# EAGLE design decoder (EAGLE 7.2.0)
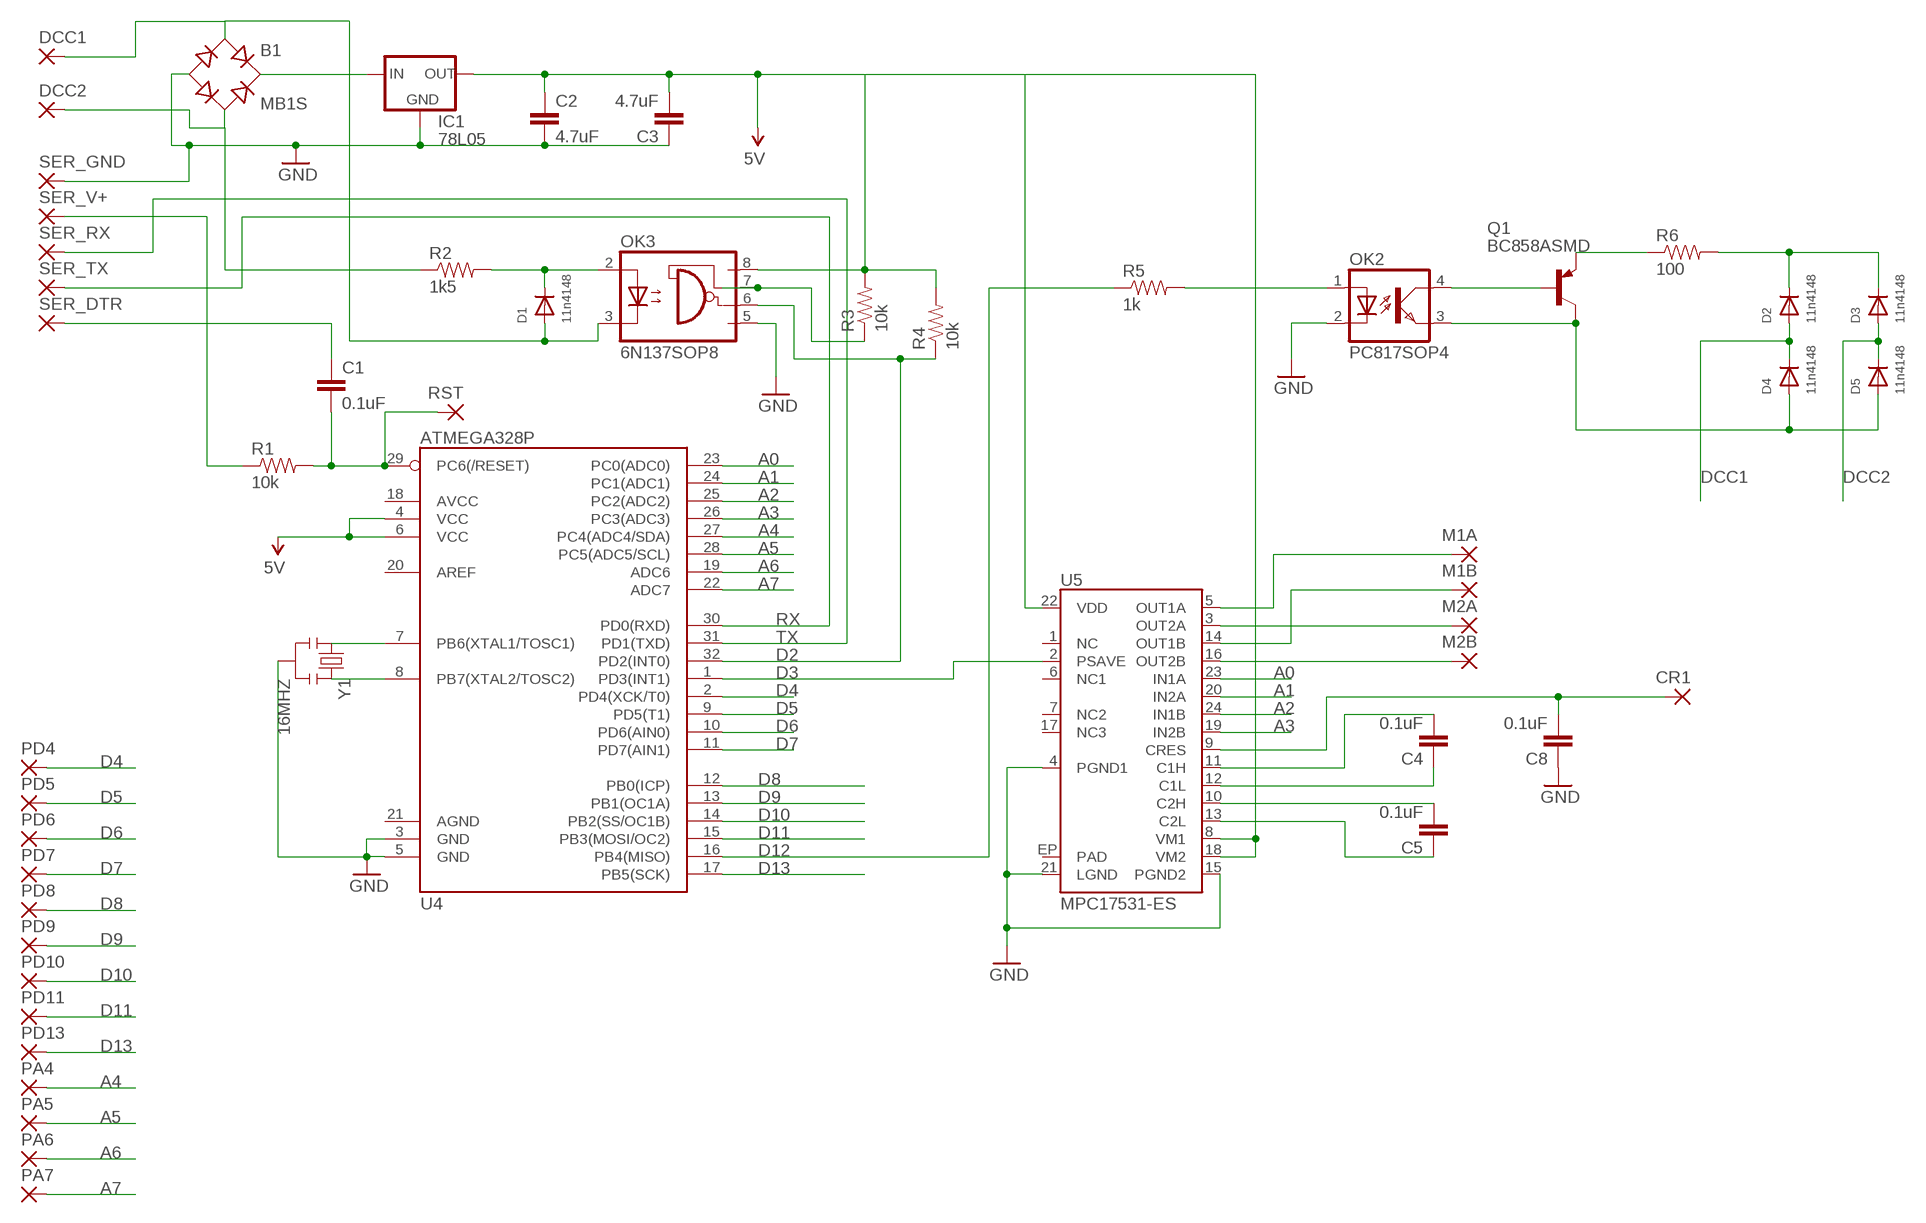
[diagram p0: schematic, sheet 1]

## Parts
B1  MB1S  [SOIC-4]
C1  0.1uF  CAP0805  [0805]
C2  4.7uF  CAP0805  [0805]
C3  4.7uF  CAP0805  [0805]
C4  0.1uF  CAP0805  [0805]
C5  0.1uF  CAP0805  [0805]
C8  0.1uF  CAP0805  [0805]
CR1  SMD2  [SMD1,27-2,54]
D1  11n4148  DIODESOD-123  [SOD-123]
D2  11n4148  DIODESOD-123  [SOD-123]
D3  11n4148  DIODESOD-123  [SOD-123]
D4  11n4148  DIODESOD-123  [SOD-123]
D5  11n4148  DIODESOD-123  [SOD-123]
DCC1  SMD2  [SMD1,27-2,54]
DCC2  SMD2  [SMD1,27-2,54]
IC1  78L05  XC63FPP  [SOT89R]
M1A  SMD2  [SMD1,27-2,54]
M1B  SMD2  [SMD1,27-2,54]
M2A  SMD2  [SMD1,27-2,54]
M2B  SMD2  [SMD1,27-2,54]
OK2  PC817SOP4  [SOP4]
OK3  6N137SOP8  [SOIC08]
PA4  SMD2  [SMD1,27-2,54]
PA5  SMD2  [SMD1,27-2,54]
PA6  SMD2  [SMD1,27-2,54]
PA7  SMD2  [SMD1,27-2,54]
PD4  SMD2  [SMD1,27-2,54]
PD5  SMD2  [SMD1,27-2,54]
PD6  SMD2  [SMD1,27-2,54]
PD7  SMD2  [SMD1,27-2,54]
PD8  SMD2  [SMD1,27-2,54]
PD9  SMD2  [SMD1,27-2,54]
PD10  SMD2  [SMD1,27-2,54]
PD11  SMD2  [SMD1,27-2,54]
PD13  SMD2  [SMD1,27-2,54]
Q1  BC858ASMD  [SOT23-BEC]
R1  10k  RESISTOR0603-RES  [0603-RES]
R2  1k5  RESISTOR0603-RES  [0603-RES]
R3  10k  RESISTOR0603-RES  [0603-RES]
R4  10k  RESISTOR0603-RES  [0603-RES]
R5  1k  RESISTOR0603-RES  [0603-RES]
R6  100  RESISTOR0603-RES  [0603-RES]
RST  SMD2  [SMD1,27-2,54]
SER_DTR  SMD2  [SMD1,27-2,54]
SER_GND  SMD2  [SMD1,27-2,54]
SER_RX  SMD2  [SMD1,27-2,54]
SER_TX  SMD2  [SMD1,27-2,54]
SER_V+  SMD2  [SMD1,27-2,54]
U4  ATMEGA328P  ATMEGA328_SMT  [TQFP32-08]
U5  MPC17531-ES  [QFN-24_ALT2]
Y1  16MHZ  RESONATOR16MHZ  [RESONATOR-SMD]

## Nets
A0: U4.23(PC0(ADC0)) U5.23(IN1A)
A1: U4.24(PC1(ADC1)) U5.20(IN2A)
A2: U4.25(PC2(ADC2)) U5.24(IN1B)
A3: U4.26(PC3(ADC3)) U5.19(IN2B)
A4: PA4.1(P) U4.27(PC4(ADC4/SDA))
A5: PA5.1(P) U4.28(PC5(ADC5/SCL))
A6: PA6.1(P) U4.19(ADC6)
A7: PA7.1(P) U4.22(ADC7)
D2: OK3.6(VO) R4.1 U4.32(PD2(INT0))
D3: U4.1(PD3(INT1)) U5.2(PSAVE)
D4: PD4.1(P) U4.2(PD4(XCK/T0))
D5: PD5.1(P) U4.9(PD5(T1))
D6: PD6.1(P) U4.10(PD6(AIN0))
D7: PD7.1(P) U4.11(PD7(AIN1))
D8: PD8.1(P) U4.12(PB0(ICP))
D9: PD9.1(P) U4.13(PB1(OC1A))
D10: PD10.1(P) U4.14(PB2(SS/OC1B))
D11: PD11.1(P) U4.15(PB3(MOSI/OC2))
D12: R5.1 U4.16(PB4(MISO))
D13: PD13.1(P) U4.17(PB5(SCK))
DCC1: B1.~1(AC1) D1.A D2.A D4.C DCC1.1(P) OK3.3(C)
DCC2: B1.~2(AC2) D3.A D5.C DCC2.1(P) R2.1
GND: B1.- C2.2 C3.1 C8.1 IC1.1(GND) OK2.2(C) OK3.5(GND) SER_GND.1(P) U4.3(GND) U4.5(GND) U5.4(PGND1) U5.15(PGND2) U5.21(LGND) Y1.2
N$1: C4.2 U5.11(C1H)
N$2: U4.7(PB6(XTAL1/TOSC1)) Y1.1
N$3: C1.1 SER_DTR.1(P)
N$4: U4.8(PB7(XTAL2/TOSC2)) Y1.3
N$5: C1.2 R1.2 RST.1(P) U4.29(PC6(/RESET))
N$6: C4.1 U5.12(C1L)
N$7: C5.2 U5.10(C2H)
N$8: D1.C OK3.2(A) R2.2
N$9: R1.1 SER_V+.1(P)
N$10: M1A.1(P) U5.5(OUT1A)
N$12: C5.1 U5.13(C2L)
N$13: OK3.7(VE) R3.1
N$14: M2A.1(P) U5.3(OUT2A)
N$15: M1B.1(P) U5.14(OUT1B)
N$16: OK2.1(A) R5.2
N$17: M2B.1(P) U5.16(OUT2B)
N$18: OK2.4(COL) Q1.B
N$19: D4.A D5.A OK2.3(EMIT) Q1.C
N$20: C8.2 CR1.1(P) U5.9(CRES)
N$21: Q1.E R6.1
N$23: U5.22(VDD)
N$24: D2.C D3.C R6.2
N$26: B1.+ IC1.2(IN)
RX: SER_TX.1(P) U4.30(PD0(RXD))
TX: SER_RX.1(P) U4.31(PD1(TXD))
VCC: C2.1 C3.2 IC1.3(OUT) OK3.8(VCC) R3.2 R4.2 U4.4(VCC) U4.6(VCC) U5.8(VM1) U5.18(VM2) ; supply symbol labelled 5V
Unconnected: U4.18(AVCC) U4.20(AREF) U4.21(AGND) U5.1(NC) U5.6(NC1) U5.7(NC2) U5.17(NC3) U5.EP(PAD)

## Library data of the parts
B1 = rectifier:MB*S: Bridge Rectifier Source: http://www.fairchildsemi.com/ds/MB/MB6S.pdf
C1-C5 C8 = SparkFun-Capacitors:CAP: Capacitor Standard 0603 ceramic capacitor, and 0.1" leaded capacitor.
CR1 DCC1 DCC2 M1A M1B M2A M2B PA4-PA7 PD4-PD11 PD13 RST SER_DTR SER_GND SER_RX SER_TX SER_V+ = wirepad:SMD2: SMD PAD
D1-D5 = adafruit:DIODE: Diode SMADIODE - SMA Surface Mount Package 20V 1A Schottky Diode Digikey: 641-1014-6-ND DO-1N4148 - Through Hole Small Current Diode SOD-123 20V 1 A (.5mV Vf) Schottky Diode - Digikey: MBRX120TPMSCT-ND SOD-323 10V 570mA (.38mV Vf, 3ns) Schottky Diode - Digikey: ZLLS410CT-ND SOD-523 30V 30mA Schottky Diode (RB751S-40TE61) - Digikey: RB751S-40TE61CT-ND SOT23-R/W - SOT23 Package (R = Solder Paste/Reflow Ovens, W = Hand-Soldering) BAT54Film 40V 300mA - Digikey: 497-7162-1-ND
IC1 = v-reg:XC63FP: Positiv Voltage Regulators www.torex.co.jp/english/product/pro02/pdf/0201_xc62fp.pdf
OK2 = optocoupler:PC817: SHARP OPTO COUPLER
OK3 = optocoupler:6N137: MOTOROLA OPTO COUPLER
Q1 = transistor-pnp:BC858*: PNP Transistror
R1-R6 = SparkFun-Resistors:RESISTOR: Resistor Basic schematic elements and footprints for 0603, 1206, and PTH resistors.
U4 = SparkFun-DigitalIC:ATMEGA328_SMT: 32-Pin Atmega328 part Commonly used on Arduino compatible boards Available in QFP and QFN packages TQFP is IC-09069 QFN is non-stock; PROD_ID: IC-09069
U5 = Arduino_merg:MPC17531: Dual Bridge Packages: TSSOP-24, 24-pin QFN Last modified: 8/20/10 Unproven!
Y1 = SparkFun-FreqCtrl:RESONATOR: Resonator Small SMD resonator. Used, eg, on the Arduino Pro/ Pro Mini boards. 8MHz- XTAL-08895 16MHz- XTAL-08900; PROD_ID: XTAL-08900

## Board
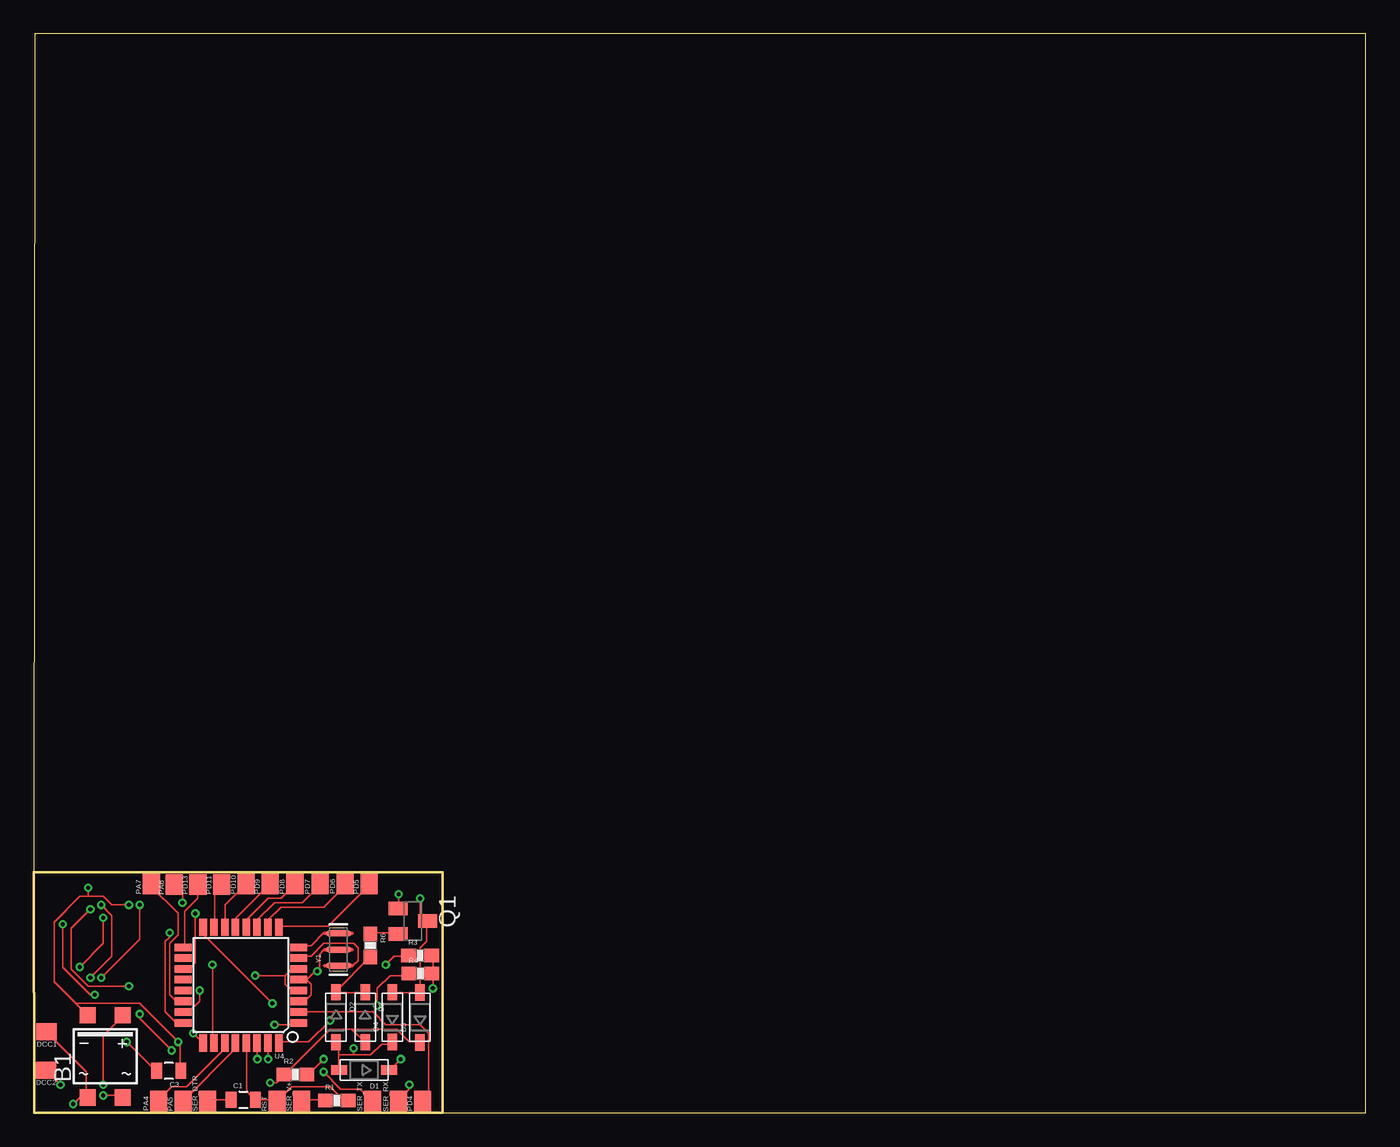
[diagram p1: board, top side]
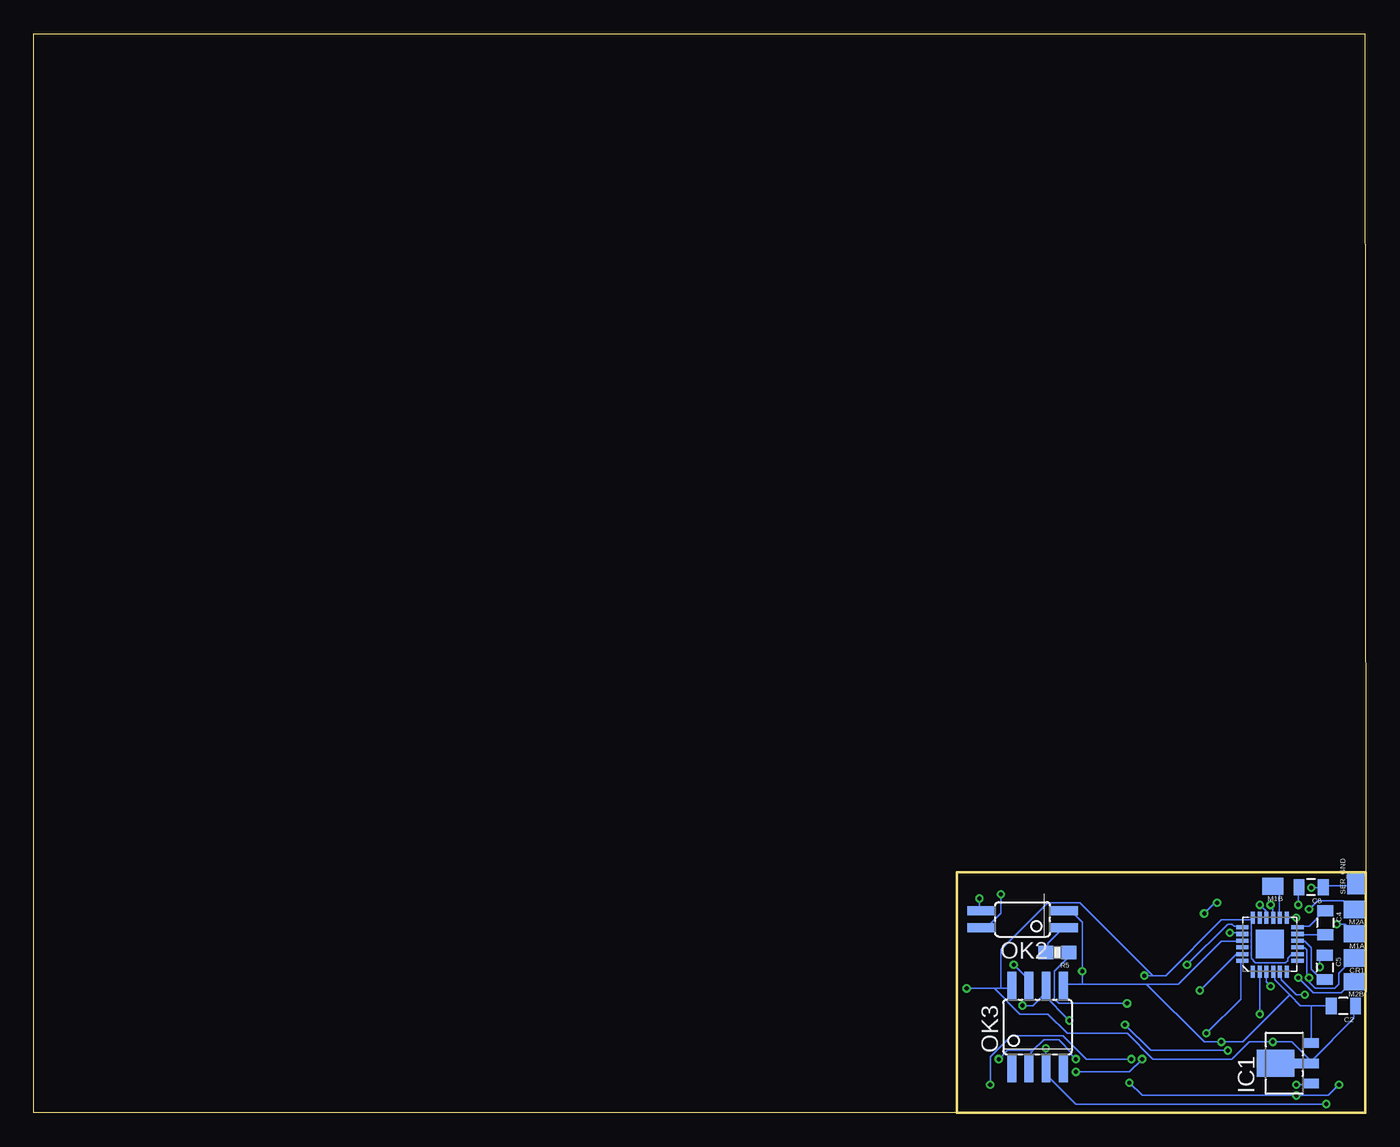
[diagram p2: board, bottom side, seen from below]

Size 98.81 x 80.03 mm. Coordinates in mm from the lower left corner, seen from the top.
Outline: 30.33,0.01 98.81,0.03 98.81,80.03 0.08,80.03 0,17.85
Outline: 0,17.85 30.33,17.84 30.33,0.01
Outline: 30.33,0.01 0.02,0 0,17.85
Copper layers (1*16): Top 0.035mm / dielectric 1.5mm / Bottom 0.035mm
Design rules "Elecrow_2-layer_eagle_rule *": minimum track width 5mil, minimum drill 12mil, track to track 6mil, track to pad 6mil, pad to pad 6mil, via to via 6mil, smd to smd 0mil, copper to edge 10mil, drill to drill 10mil, minimum pad ring 10mil, minimum via ring 6mil, stop-mask expansion 2mil, vias tented up to drill 100mil, thermal gap 10mil

### Footprints (pad centres in the part's own frame; a part is rotated, then mirrored left to right if it is on the bottom)
SOIC-4 = smd 1.2 x 1.2: + 1.3,3.05; - -1.3,3.05; ~1 -1.3,-3.05; ~2 1.3,-3.05
0805 = smd 0.8 x 1.2: 1 -0.9,0; 2 0.9,0
SMD1,27-2,54 = smd 1.27 x 1.524: 1 0,0
SOD-123 = smd 1.2 x 0.7: A 1.85,0; C -1.85,0
SOT89R = smd 0.7 x 1.1: 1 1.5,-1.75; 2 -1.5,-1.75 | smd 0.7 x 1.8: 3 0,-1.4 | smd 2 x 2.8: 4 0,0.9
SOP4 = smd 0.66 x 2.032: 1 -3.175,-1.803; 2 -1.905,-1.803; 3 -1.905,4.343; 4 -3.175,4.343
SOIC08 = smd 0.66 x 2.032: 1 -1.905,-3.073; 2 -0.635,-3.073; 3 0.635,-3.073; 4 1.905,-3.073; 5 1.905,3.073; 6 0.635,3.073; 7 -0.635,3.073; 8 -1.905,3.073
SOT23-BEC = smd 1 x 1.4: B -0.95,-1.1; C 0,1.1; E 0.95,-1.1
0603-RES = smd 1.1 x 1: 1 -0.85,0; 2 0.85,0
TQFP32-08 = smd 1.27 x 0.559: 1 -4.293,2.8; 2 -4.293,2; 3 -4.293,1.2; 4 -4.293,0.4; 5 -4.293,-0.4; 6 -4.293,-1.2; 7 -4.293,-2; 8 -4.293,-2.8; 17 4.293,-2.8; 18 4.293,-2; 19 4.293,-1.2; 20 4.293,-0.4; 21 4.293,0.4; 22 4.293,1.2; 23 4.293,2; 24 4.293,2.8 | smd 0.559 x 1.27: 9 -2.8,-4.293; 10 -2,-4.293; 11 -1.2,-4.293; 12 -0.4,-4.293; 13 0.4,-4.293; 14 1.2,-4.293; 15 2,-4.293; 16 2.8,-4.293; 25 2.8,4.293; 26 2,4.293; 27 1.2,4.293; 28 0.4,4.293; 29 -0.4,4.293; 30 -1.2,4.293; 31 -2,4.293; 32 -2.8,4.293
QFN-24_ALT2 = smd 0.9 x 0.3: 1 -2.05,1.25; 2 -2.05,0.75; 3 -2.05,0.25; 4 -2.05,-0.25; 5 -2.05,-0.75; 6 -2.05,-1.25; 13 1.95,-1.25; 14 1.95,-0.75; 15 1.95,-0.25; 16 1.95,0.25; 17 1.95,0.75; 18 1.95,1.25 | smd 0.3 x 0.9: 7 -1.25,-2.05; 8 -0.75,-2.05; 9 -0.25,-2.05; 10 0.25,-2.05; 11 0.75,-2.05; 12 1.25,-2.05; 19 1.25,2.05; 20 0.75,2.05; 21 0.25,2.05; 22 -0.25,2.05; 23 -0.75,2.05; 24 -1.25,2.05 | smd 2.1 x 2.1: EP 0,0
RESONATOR-SMD = smd 0.45 x 1.905: 1 -1.2,0; 2 0,0; 3 1.2,0

### Placement (x,y rotation side)
B1  5.3,4.19 0 top
C1  15.55,0.97 0 top
C2  1.67,7.93 180 bottom
C3  10.02,3.12 180 top
C4  3.01,14.1 270 bottom
C5  3.04,10.79 270 bottom
C8  4.05,16.74 180 bottom
CR1  0.87,11.49 90 bottom
D1  24.52,3.18 180 top
D2  22.43,7.1 270 top
D3  24.59,7.09 270 top
D4  26.6,7.11 90 top
D5  28.65,7.08 90 top
DCC1  0.96,6.01 90 top
DCC2  0.9,3.18 90 top
IC1  5.8,3.68 90 bottom
M1A  0.86,13.3 90 bottom
M1B  6.9,16.81 90 bottom
M2A  0.89,15.08 90 bottom
M2B  0.89,9.73 90 bottom
OK2  24.19,16.89 90 bottom
OK3  24.35,6.37 0 bottom
PA4  9.28,0.9 0 top
PA5  11.07,0.88 0 top
PA6  10.42,16.93 0 top
PA7  8.73,16.96 0 top
PD4  28.85,0.88 0 top
PD5  24.87,16.96 0 top
PD6  23.11,16.99 0 top
PD7  21.26,16.96 0 top
PD8  19.38,16.96 0 top
PD9  17.53,16.96 0 top
PD10  15.76,16.96 0 top
PD11  13.94,16.95 0 top
PD13  12.18,16.95 0 top
Q1  28.13,14.22 270 top
R1  22.49,0.92 0 top
R2  19.42,2.85 0 top
R3  28.66,11.67 0 top
R4  28.68,10.33 0 top
R5  22.87,11.9 180 bottom
R6  24.96,12.42 270 top
RST  18.05,0.87 0 top
SER_DTR  12.91,0.9 0 top
SER_GND  0.75,16.99 0 bottom
SER_RX  27.06,0.87 0 top
SER_TX  25.13,0.9 0 top
SER_V+  19.89,0.89 0 top
U4  15.37,9.48 180 top
U5  7.12,12.52 90 bottom
Y1  22.61,12.12 90 top

### Tracks (layer width: path | path; a pad name or v marks a point on that pad's centre or on a via)
A0  (via drill 0.3)
  Top 0.127: v12.31,9.07 12.31,8.28 11.51,7.49 11.2,7.49 U4.23
  Bottom 0.127: v12.31,9.07 9.61,11.77 9.29,11.77 U5.23
A1  (via drill 0.3)
  Top 0.127: v10.08,13.36 10.08,13.04 9.77,12.73 9.77,7.49 10.56,6.69 11.04,6.69 U4.24
  Bottom 0.127: v10.08,13.36 9.29,13.36 U5.20
A2  (via drill 0.3)
  Top 0.127: v11.83,5.9 12.46,5.26 U4.25
  Bottom 0.127: v11.83,5.9 9.29,8.44 9.29,11.14 U5.24
A3  (via drill 0.3)
  Top 0.127: v13.26,10.98 13.26,5.26 U4.26
  Bottom 0.127: v13.26,10.98 10.24,14 9.93,14 9.77,13.84 9.29,13.84 U5.19
A4
  Top 0.127: U4.27 14.05,5.11 14.05,4.63 11.35,1.93 10.24,1.93 9.29,0.98 PA4.1
A5
  Top 0.127: U4.28 14.85,5.11 14.85,4.63 11.2,0.98 PA5.1
A6  (via drill 0.3)
  Top 0.127: v11.99,14.79 11.99,11.14 11.67,10.82 11.2,10.82 U4.19 | v11.04,15.58 11.04,16.38 10.56,16.85 PA6.1
  Bottom 0.127: v11.99,14.79 11.2,15.58 v11.04,15.58
A7
  Top 0.127: U4.22 11.04,8.28 10.56,8.28 10.08,8.76 10.08,12.57 10.72,13.2 10.72,14.79 8.65,16.85 PA7.1
D2  (via drill 0.3)
  Top 0.127: v25.48,7.96 25.48,9.23 26.43,10.19 27.7,10.19 R4.1 | v21.99,6.85 20.4,5.26 18.18,5.26 U4.32
  Bottom 0.127: v25.48,7.96 24.69,7.96 23.89,8.76 | 23.89,8.76 23.74,8.92 23.74,9.39 OK3.6 23.89,8.76 | 23.89,8.76 v21.99,6.85
D3  (via drill 0.3)
  Top 0.127: v7.86,7.33 7.86,7.01 v10.24,4.63 | v17.86,6.53 19.61,6.53 U4.1
  Bottom 0.127: v7.86,7.33 7.86,10.34 U5.2 | v10.24,4.63 15.96,4.63 v17.86,6.53
D4
  Top 0.127: U4.2 19.77,7.49 25.16,7.49 26.12,6.53 28.66,6.53 29.29,5.9 29.29,1.3 28.98,0.98 PD4.1
D5
  Top 0.127: U4.9 18.18,13.84 21.83,13.84 24.85,16.85 PD5.1
D6
  Top 0.127: U4.10 17.39,13.84 17.39,14.31 18.34,15.27 21.51,15.27 23.1,16.85 PD6.1
D7
  Top 0.127: U4.11 16.59,13.84 16.59,14.31 17.86,15.58 19.93,15.58 21.2,16.85 PD7.1
D8
  Top 0.127: U4.12 15.8,13.84 15.8,14.31 17.39,15.9 18.34,15.9 19.29,16.85 PD8.1
D9
  Top 0.127: U4.13 15,13.84 15,14.47 17.39,16.85 PD9.1
D10
  Top 0.127: U4.14 14.21,13.84 14.21,15.42 15.64,16.85 PD10.1
D11
  Top 0.127: U4.15 13.42,13.84 13.42,16.38 13.89,16.85 PD11.1
D12  (via drill 0.3)
  Top 0.127: v17.7,8.12 12.62,13.2 12.62,13.68 U4.16
  Bottom 0.127: v17.7,8.12 22.78,8.12 23.1,8.44 23.1,10.5 22.15,11.46 22.15,11.77 R5.1
D13
  Top 0.127: U4.17 11.2,12.41 11.2,14.95 12.15,15.9 12.15,16.85 PD13.1
DCC1  (via drill 0.3)
  Top 0.127: 22.62,4.31 22.62,4.95 22.47,5.11 D2.A | 22.62,4.31 22.62,3.2 D1.A | 22.62,4.31 23.74,4.31 | 23.74,4.31 25.01,4.31 25.8,5.11 26.59,5.11 D4.C | 23.74,4.31 v23.74,4.79 | 3.89,1.61 3.89,3.04 1.04,5.9 DCC1.1 | 3.89,1.61 3.89,1.3 B1.~1 3.89,1.61 | 3.89,1.61 v2.94,0.66
  Bottom 0.127: v23.74,4.79 23.74,3.36 OK3.3 23.58,3.2 23.58,2.72 21.51,0.66 v2.94,0.66
DCC2  (via drill 0.3)
  Top 0.127: v5.16,1.3 6.59,1.3 B1.~2 | v1.99,2.09 1.04,3.04 DCC2.1 | 23.58,6.22 21.99,6.22 18.66,2.88 R2.1 18.5,2.72 18.02,2.25 v17.55,2.25 | 23.58,6.22 24.53,5.26 D3.A | 23.58,6.22 26.91,6.22 27.86,5.26 28.5,5.26 D5.C
  Bottom 0.127: v1.99,2.09 2.78,1.3 v5.16,1.3 16.59,1.3 v17.55,2.25
GND  (via drill 0.3)
  Top 0.127: v7.07,15.42 5.8,15.42 5.16,16.06 4.05,16.06 | 4.05,16.06 3.42,16.06 1.51,14.15 1.51,9.71 3.1,8.12 | 3.1,8.12 3.89,7.33 B1.- | 3.1,8.12 7.86,8.12 v10.72,5.26 10.88,5.11 10.88,3.2 C3.1 | 4.05,16.06 v4.05,16.69 | 20.24,9.87 20.56,9.55 20.56,8.76 20.09,8.28 19.77,8.28 U4.3 | 20.24,9.87 19.77,9.87 U4.5 20.24,9.87 | 20.88,10.5 21.2,10.82 21.2,11.77 21.51,12.09 21.6,12.12 | 20.88,10.5 20.24,9.87 | v21.04,10.5 20.88,10.5
  Bottom 0.127: SER_GND.1 0.88,16.85 3.1,16.85 C8.1 3.26,16.69 v4.05,16.69 | v7.07,15.42 6.91,15.27 6.91,14.47 U5.15 | 5.64,8.76 4.84,7.96 4.05,7.96 | 5.64,8.76 6.75,9.87 6.75,10.34 U5.4 | 4.05,7.96 2.62,7.96 C2.2 | 4.05,7.96 4.05,5.26 IC1.1 | 21.04,9.55 22.31,9.55 OK3.5 | 21.04,9.55 16.27,9.55 | 16.27,9.55 13.89,9.55 10.72,12.73 9.29,12.73 U5.21 | 21.04,9.55 v21.04,10.5 21.04,14.15 21.83,14.95 22.31,14.95 OK2.2 | 5.64,8.76 9.13,5.26 v10.72,5.26 11.99,5.26 16.27,9.55
N$1
  Bottom 0.127: U5.11 5,13.2 3.1,13.2 C4.2
N$2
  Top 0.127: U4.7 19.77,11.61 20.56,11.61 21.51,12.57 23.74,12.57 24.05,12.25 24.05,11.3 23.74,10.98 Y1.1
N$3
  Top 0.127: C1.1 14.53,0.98 12.94,0.98 SER_DTR.1
N$4
  Top 0.127: U4.8 19.77,12.41 20.56,12.41 21.51,13.36 21.6,13.32
N$5
  Top 0.127: R1.2 23.26,0.98 22.94,0.98 21.99,1.93 19.13,1.93 18.18,0.98 RST.1 18.02,0.98 16.59,0.98 C1.2 16.43,0.98 15.8,1.61 15.8,5.11 U4.29
N$6
  Bottom 0.127: U5.12 5,13.84 4.21,13.84 3.1,14.95 C4.1
N$7
  Bottom 0.127: U5.10 5,12.73 4.53,12.73 4.05,12.25 4.05,10.66 3.42,10.03 3.1,10.03 C5.2
N$8  (via drill 0.3)
  Top 0.127: v21.51,3.99 20.4,2.88 R2.2 | v27.23,3.99 26.43,3.2 D1.C
  Bottom 0.127: v21.51,3.99 21.83,4.31 21.83,4.47 22.78,5.42 23.89,5.42 24.69,4.63 | 24.69,4.63 24.85,4.47 24.85,3.36 OK3.2 | v27.23,3.99 26.59,4.63 24.69,4.63
N$9
  Top 0.127: R1.1 21.51,0.98 19.93,0.98 SER_V+.1
N$10  (via drill 0.3)
  Top 0.127: v4.53,8.76 4.21,8.76 2.15,10.82 v2.15,14
  Bottom 0.127: v4.53,8.76 5.16,8.76 6.27,9.87 6.27,10.34 U5.5 | v2.15,14 1.51,14 0.88,13.36 M1A.1
N$12  (via drill 0.3)
  Top 0.127: v5.16,14.47 5.16,12.57 v3.42,10.82
  Bottom 0.127: v5.16,14.47 5.8,14.47 U5.13 | v3.42,10.82 3.42,11.3 3.1,11.61 C5.1
N$13  (via drill 0.3)
  Top 0.127: v26.12,10.98 26.75,11.61 27.7,11.61 R3.1
  Bottom 0.127: v26.12,10.98 25.01,9.87 25.01,9.55 OK3.7
N$14  (via drill 0.3)
  Top 0.127: v7.07,9.39 4.05,9.39 2.78,10.66 2.78,13.68 v4.21,15.11
  Bottom 0.127: v7.07,9.39 7.38,9.71 7.38,10.34 U5.3 | v4.21,15.11 3.58,15.74 1.67,15.74 1.04,15.11 M2A.1
N$15
  Bottom 0.127: U5.14 6.43,14.47 6.43,16.38 6.75,16.69 M1B.1
N$16
  Bottom 0.127: R5.2 23.58,11.93 23.58,12.57 22.47,13.68 OK2.1
N$17  (via drill 0.3)
  Top 0.127: v7.86,15.42 7.86,12.88 v5,10.03
  Bottom 0.127: v7.86,15.42 7.38,14.95 7.38,14.47 U5.16 | v5,10.03 3.89,8.92 1.83,8.92 1.04,9.71 M2B.1
N$18  (via drill 0.3)
  Top 0.127: v27.07,16.22 27.07,15.27 Q1.B
  Bottom 0.127: v27.07,16.22 27.07,14.79 28.02,13.84 28.5,13.84 OK2.4
N$19  (via drill 0.3)
  Top 0.127: D4.A 26.75,8.92 28.5,8.92 D5.A 28.66,9.07 28.66,12.25 29.13,12.73 29.13,14.15 Q1.C 29.13,14.31 28.66,14.79 v28.66,15.9
  Bottom 0.127: v28.66,15.9 28.66,15.11 OK2.3
N$20  (via drill 0.3)
  Top 0.127: v5,15.42 5.8,14.63 5.8,11.61 v4.21,10.03
  Bottom 0.127: 4.37,10.03 4.37,9.87 3.73,9.23 2.31,9.23 1.99,9.55 1.99,10.34 0.88,11.46 CR1.1 | 4.37,10.03 4.37,12.09 4.53,12.25 5,12.25 U5.9 | v5,15.42 5,16.69 C8.2 | 4.37,10.03 v4.21,10.03
N$21
  Top 0.127: R6.1 25.01,13.36 26.91,13.36 Q1.E
N$24
  Top 0.127: R6.2 24.85,11.46 22.47,9.07 D2.C 22.47,8.92 24.53,8.92 D3.C
N$26  (via drill 0.3)
  Top 0.127: v5.16,2.09 5.16,5.74 6.59,7.17 B1.+
  Bottom 0.127: v5.16,2.09 4.05,2.09 IC1.2
RX  (via drill 0.3)
  Top 0.127: v16.59,3.99 16.59,5.11 U4.30 | v21.51,3.04 22.78,1.77 24.21,1.77 25.01,0.98 SER_TX.1
  Bottom 0.127: v16.59,3.99 17.55,3.04 v21.51,3.04
TX  (via drill 0.3)
  Top 0.127: v17.39,3.99 17.39,5.11 U4.31 | v27.86,2.09 27.86,1.77 27.07,0.98 SER_RX.1
  Bottom 0.127: v17.39,3.99 20.72,3.99 22.47,5.74 26.28,5.74 27.86,4.15 v27.86,2.09
VCC  (via drill 0.3)
  Top 0.127: v6.91,5.26 8.97,3.2 C3.2 | R3.2 29.61,11.61 29.61,10.34 R4.2 29.61,10.19 v29.61,9.23 | 18.66,10.19 18.66,9.55 18.97,9.23 19.61,9.23 U4.4 | 18.66,10.19 19.13,10.66 19.61,10.66 U4.6 | v16.43,10.19 18.66,10.19
  Bottom 0.127: 4.05,3.84 4.37,3.52 IC1.3 4.05,3.84 | 4.05,3.84 0.88,7.01 0.88,7.8 C2.1 | 4.05,3.84 5.48,5.26 v6.91,5.26 8.65,5.26 9.93,3.99 15.8,3.99 17.7,5.9 22.15,5.9 23.58,7.33 25.64,7.33 27.55,9.23 | 27.07,9.23 26.43,9.23 26.28,9.39 OK3.8 | 27.07,9.23 27.55,9.23 | 27.55,9.23 v29.61,9.23 | 8.5,14.31 8.5,11.46 8.18,11.14 5.96,11.14 5.8,11.3 5.8,11.46 5.48,11.77 5.16,11.77 U5.8 | 15.8,10.19 14.85,10.19 10.72,14.31 8.5,14.31 | 15.8,10.19 v16.43,10.19 | 8.5,14.31 U5.18 | 27.07,9.23 27.07,12.09 23.58,15.58 21.2,15.58 15.8,10.19